# EAGLE schematic specMech (EAGLE 9.6.2)

## Sheet 1 of 7: MCU

## Sheet 2 of 7: Lantronix XPORT Ethernet
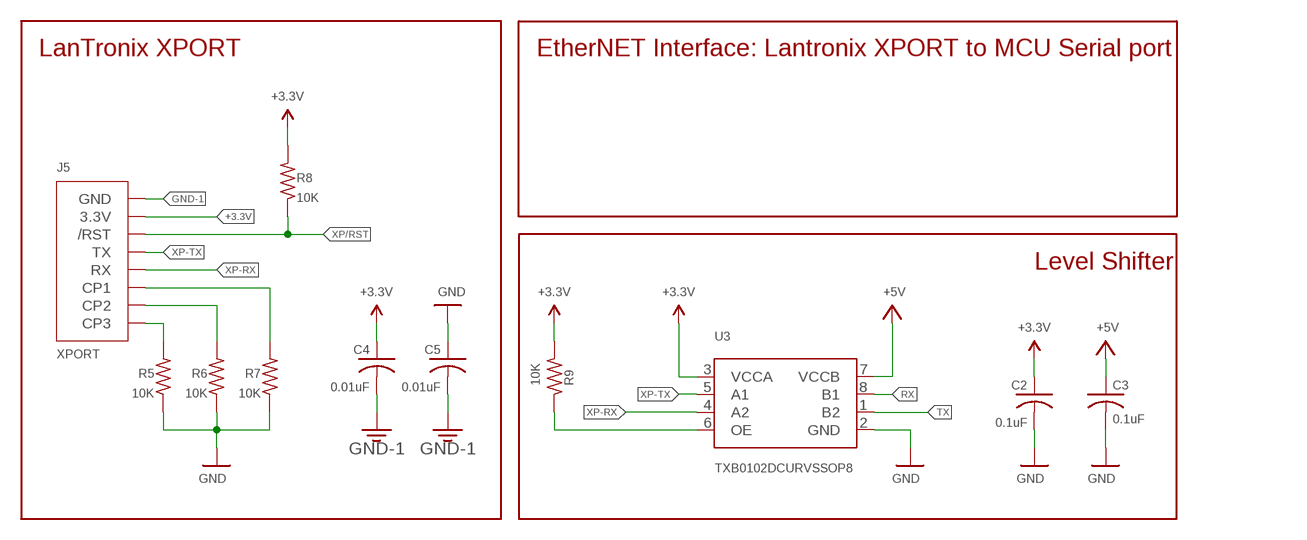
[diagram p0: schematic, sheet 2]

### Parts
C2  0.1uF  C-USC0805  [C0805]
C3  0.1uF  C-USC0805  [C0805]
C4  0.01uF  C-USC0805  [C0805]
C5  0.01uF  C-USC0805  [C0805]
J5  XPORT  XPORTXPORT-2  [XPORT-2]
R5  10K  R-US_R0805  [R0805]
R6  10K  R-US_R0805  [R0805]
R7  10K  R-US_R0805  [R0805]
R8  10K  R-US_R0805  [R0805]
R9  10K  R-US_R0805  [R0805]
U3  TXB0102DCURVSSOP8  [GHI-IC_VSSOP8(TI)]

### Nets
+3.3V: C2.1 C4.1 J5.3.3V R8.2 R9.2 U3.3(VCCA)
+5V: C3.1 U3.7(VCCB) ; also sheet 3,4,5,6,7
GND: C2.2 C3.2 C5.1 R5.1 R6.1 R7.1 U3.2(GND) ; also sheet 3,4,5,6,7
GND-1: C4.2 C5.2 J5.GND
N$40: J5.CP3 R5.2
N$41: J5.CP2 R6.2
N$42: J5.CP1 R7.2
N$43: R9.1 U3.6(OE)
RX: U3.8(B1)
TX: U3.1(B2)
XP-RX: J5.RX U3.4(A2)
XP-TX: J5.TX U3.5(A1)
XP/RST: J5./RST R8.1

### Notes on the sheet
- LanTronix XPORT | EtherNET Interface: Lantronix XPORT to MCU Serial port
- Level Shifter

## Sheet 3 of 7: Power
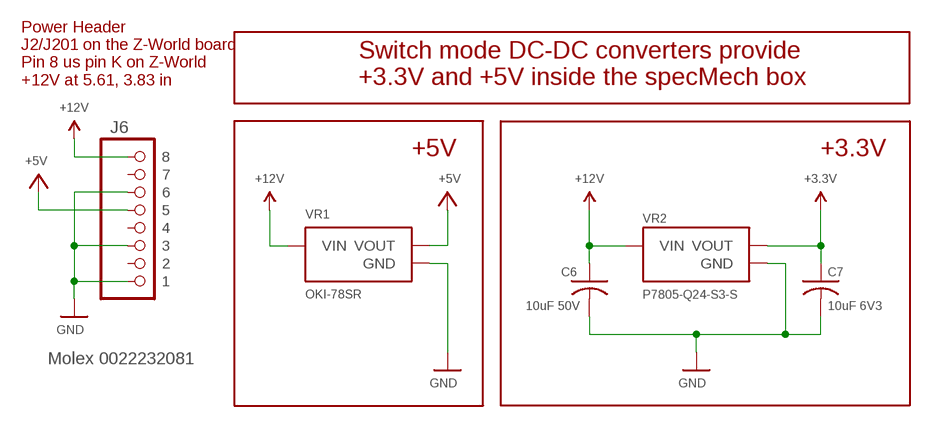
[diagram p1: schematic, sheet 3]

### Parts
C6  10uF 50V  C-USC1210  [C1210]
C7  10uF 6V3  C-USC0805  [C0805]
J6  Molex 0022232081  PINHD-1X8-MOLEX-SHROUD  [1X08-MOLEX-SHROUD]
VR1  OKI-78SR  [OKI-78SR]
VR2  P7805-Q24-S3-S  [CONV_P7805-Q24-S3-S]

### Nets
3.3V: C7.1 VR2.VOUT ; supply symbol labelled +3.3V
+5V: J6.P$5 VR1.VOUT ; also sheet 2,4,5,6,7
+12V: C6.1 J6.P$8 VR1.VIN VR2.VIN ; also sheet 6
GND: C6.2 C7.2 J6.P$1 J6.P$3 J6.P$6 VR1.GND VR2.GND ; also sheet 2,4,5,6,7
Unconnected: J6.P$2 J6.P$4 J6.P$7

### Notes on the sheet
- Power Header
  J2/J201 on the Z-World board
  Pin 8 us pin K on Z-World
  +12V at 5.61, 3.83 in
- Switch mode DC-DC converters provide
  +3.3V and +5V inside the specMech box
- +5V | +3.3V

## Sheet 4 of 7: Sensors
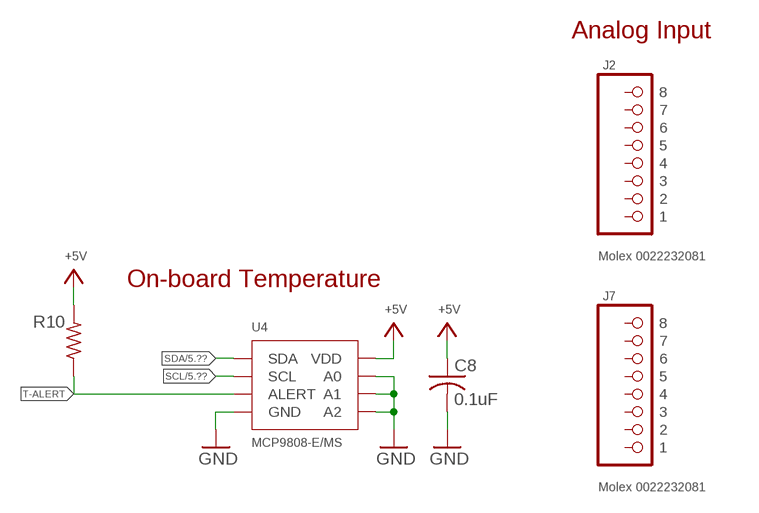
[diagram p2: schematic, sheet 4]

### Parts
C8  0.1uF  C-USC0805  [C0805]
J2  Molex 0022232081  PINHD-1X8-MOLEX-SHROUD  [1X08-MOLEX-SHROUD]
J7  Molex 0022232081  PINHD-1X8-MOLEX-SHROUD  [1X08-MOLEX-SHROUD]
R10  R-US_R0805  [R0805]
U4  MCP9808-E/MS  [MSOP8_MC_MCH]

### Nets
+5V: C8.1 R10.2 U4.8(VDD) ; also sheet 2,3,5,6,7
GND: C8.2 U4.4(GND) U4.5(A2) U4.6(A1) U4.7(A0) ; also sheet 2,3,5,6,7
SCL: U4.2(SCL) ; also sheet 5,6,7
SDA: U4.1(SDA) ; also sheet 5,6,7
T-ALERT: R10.1 U4.3(ALERT)
Unconnected: J2.P$1 J2.P$2 J2.P$3 J2.P$4 J2.P$5 J2.P$6 J2.P$7 J2.P$8 J7.P$1 J7.P$2 J7.P$3 J7.P$4 J7.P$5 J7.P$6 J7.P$7 J7.P$8

### Notes on the sheet
- Analog Input
- On-board Temperature

## Sheet 5 of 7: Digital I/O
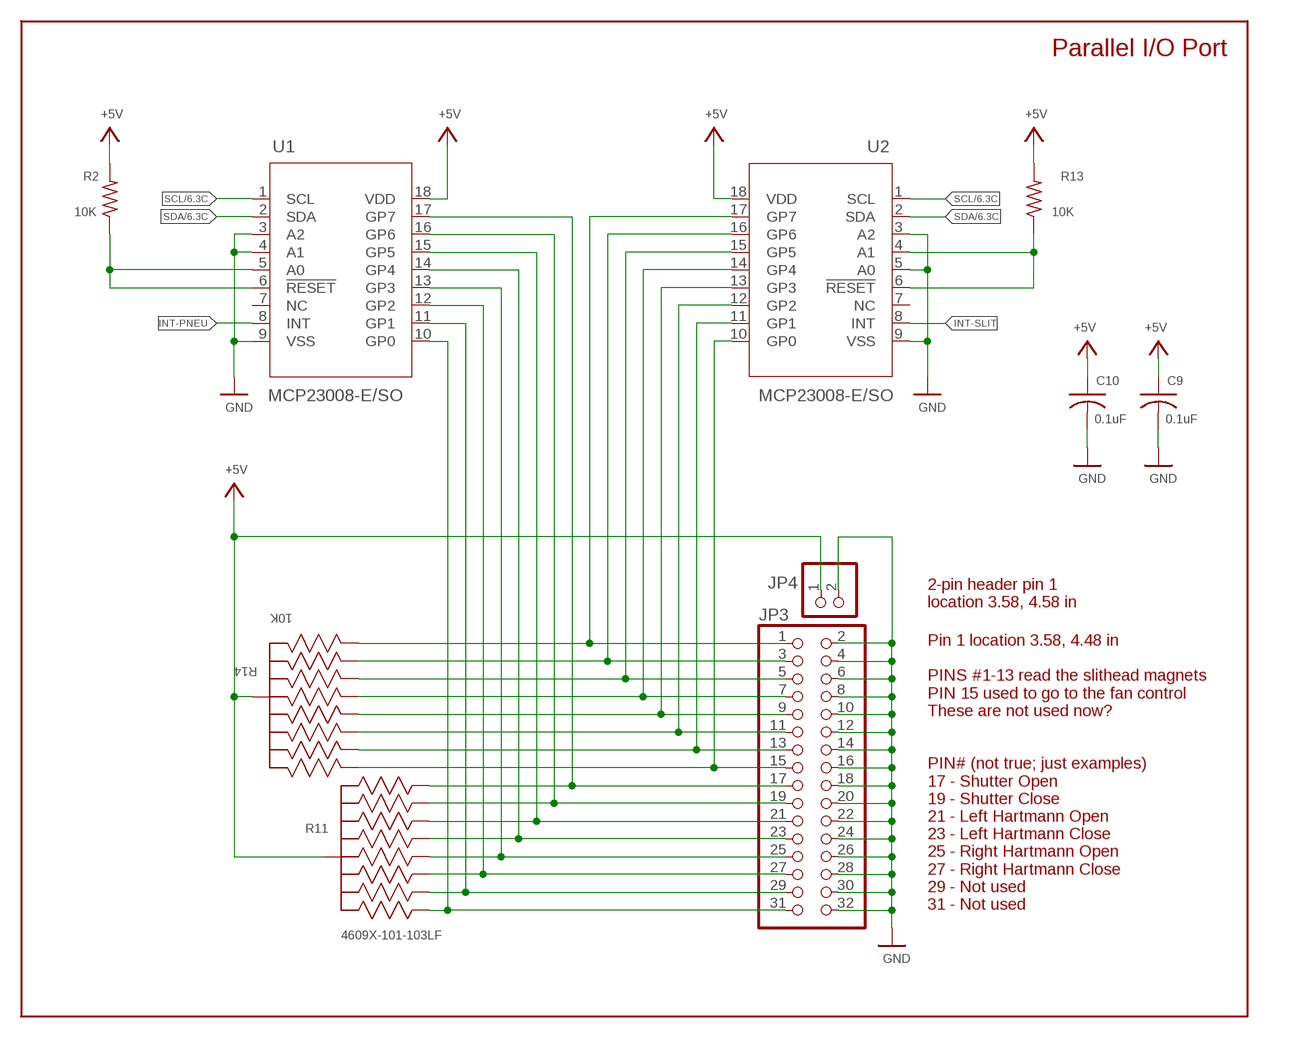
[diagram p3: schematic, sheet 5]

### Parts
C9  0.1uF  C-USC0805  [C0805]
C10  0.1uF  C-USC0805  [C0805]
JP3  PINHD-2X16  [2X16]
JP4  PINHD-1X2  [1X02]
R2  10K  R-US_R0805  [R0805]
R11  4609X-101-103LF  [BO_4609X]
R13  10K  R-US_R0805  [R0805]
R14  10K  4609X-101-103LF  [BO_4609X]
U1  MCP23008-E/SO  [SOIC18-W_MC]
U2  MCP23008-E/SO  [SOIC18-W_MC]

### Nets
+5V: C9.1 C10.1 JP4.1 R2.2 R11.1 R13.2 R14.1 U1.18(VDD) U2.18(VDD) ; also sheet 2,3,4,6,7
GND: C9.2 C10.2 JP3.2 JP3.4 JP3.6 JP3.8 JP3.10 JP3.12 JP3.14 JP3.16 JP3.18 JP3.20 JP3.22 JP3.24 JP3.26 JP3.28 JP3.30 JP3.32 JP4.2 U1.3(A2) U1.4(A1) U1.9(VSS) U2.3(A2) U2.5(A0) U2.9(VSS) ; also sheet 2,3,4,6,7
INT-PNEU: U1.8(INT)
INT-SLIT: U2.8(INT)
N$1: JP3.1 R14.2 U2.17(GP7)
N$2: JP3.3 R14.3 U2.16(GP6)
N$3: JP3.5 R14.4 U2.15(GP5)
N$4: JP3.7 R14.5 U2.14(GP4)
N$9: JP3.17 R11.9 U1.17(GP7)
N$10: JP3.19 R11.8 U1.16(GP6)
N$11: JP3.21 R11.7 U1.15(GP5)
N$12: JP3.23 R11.6 U1.14(GP4)
N$13: JP3.25 R11.5 U1.13(GP3)
N$14: R2.1 U1.5(A0) U1.6(!RESET)
N$15: JP3.29 R11.3 U1.11(GP1)
N$16: JP3.31 R11.2 U1.10(GP0)
N$17: JP3.11 R14.7 U2.12(GP2)
N$20: JP3.27 R11.4 U1.12(GP2)
N$21: JP3.13 R14.8 U2.11(GP1)
N$22: JP3.15 R14.9 U2.10(GP0)
N$24: R13.1 U2.4(A1) U2.6(!RESET)
N$36: JP3.9 R14.6 U2.13(GP3)
SCL: U1.1(SCL) U2.1(SCL) ; also sheet 4,6,7
SDA: U1.2(SDA) U2.2(SDA) ; also sheet 4,6,7
Unconnected: U1.7(NC) U2.7(NC)

### Notes on the sheet
- Parallel I/O Port
- 2-pin header pin 1
  location 3.58, 4.58 in
- Pin 1 location 3.58, 4.48 in
  
  PINS #1-13 read the slithead magnets
  PIN 15 used to go to the fan control
  These are not used now?
  
  
  PIN# (not true; just examples)
  17 - Shutter Open
  19 - Shutter Close
  21 - Left Hartmann Open
  23 - Left Hartmann Close
  25 - Right Hartmann Open
  27 - Right Hartmann Close
  29 - Not used
  31 - Not used

## Sheet 6 of 7: High Current Output
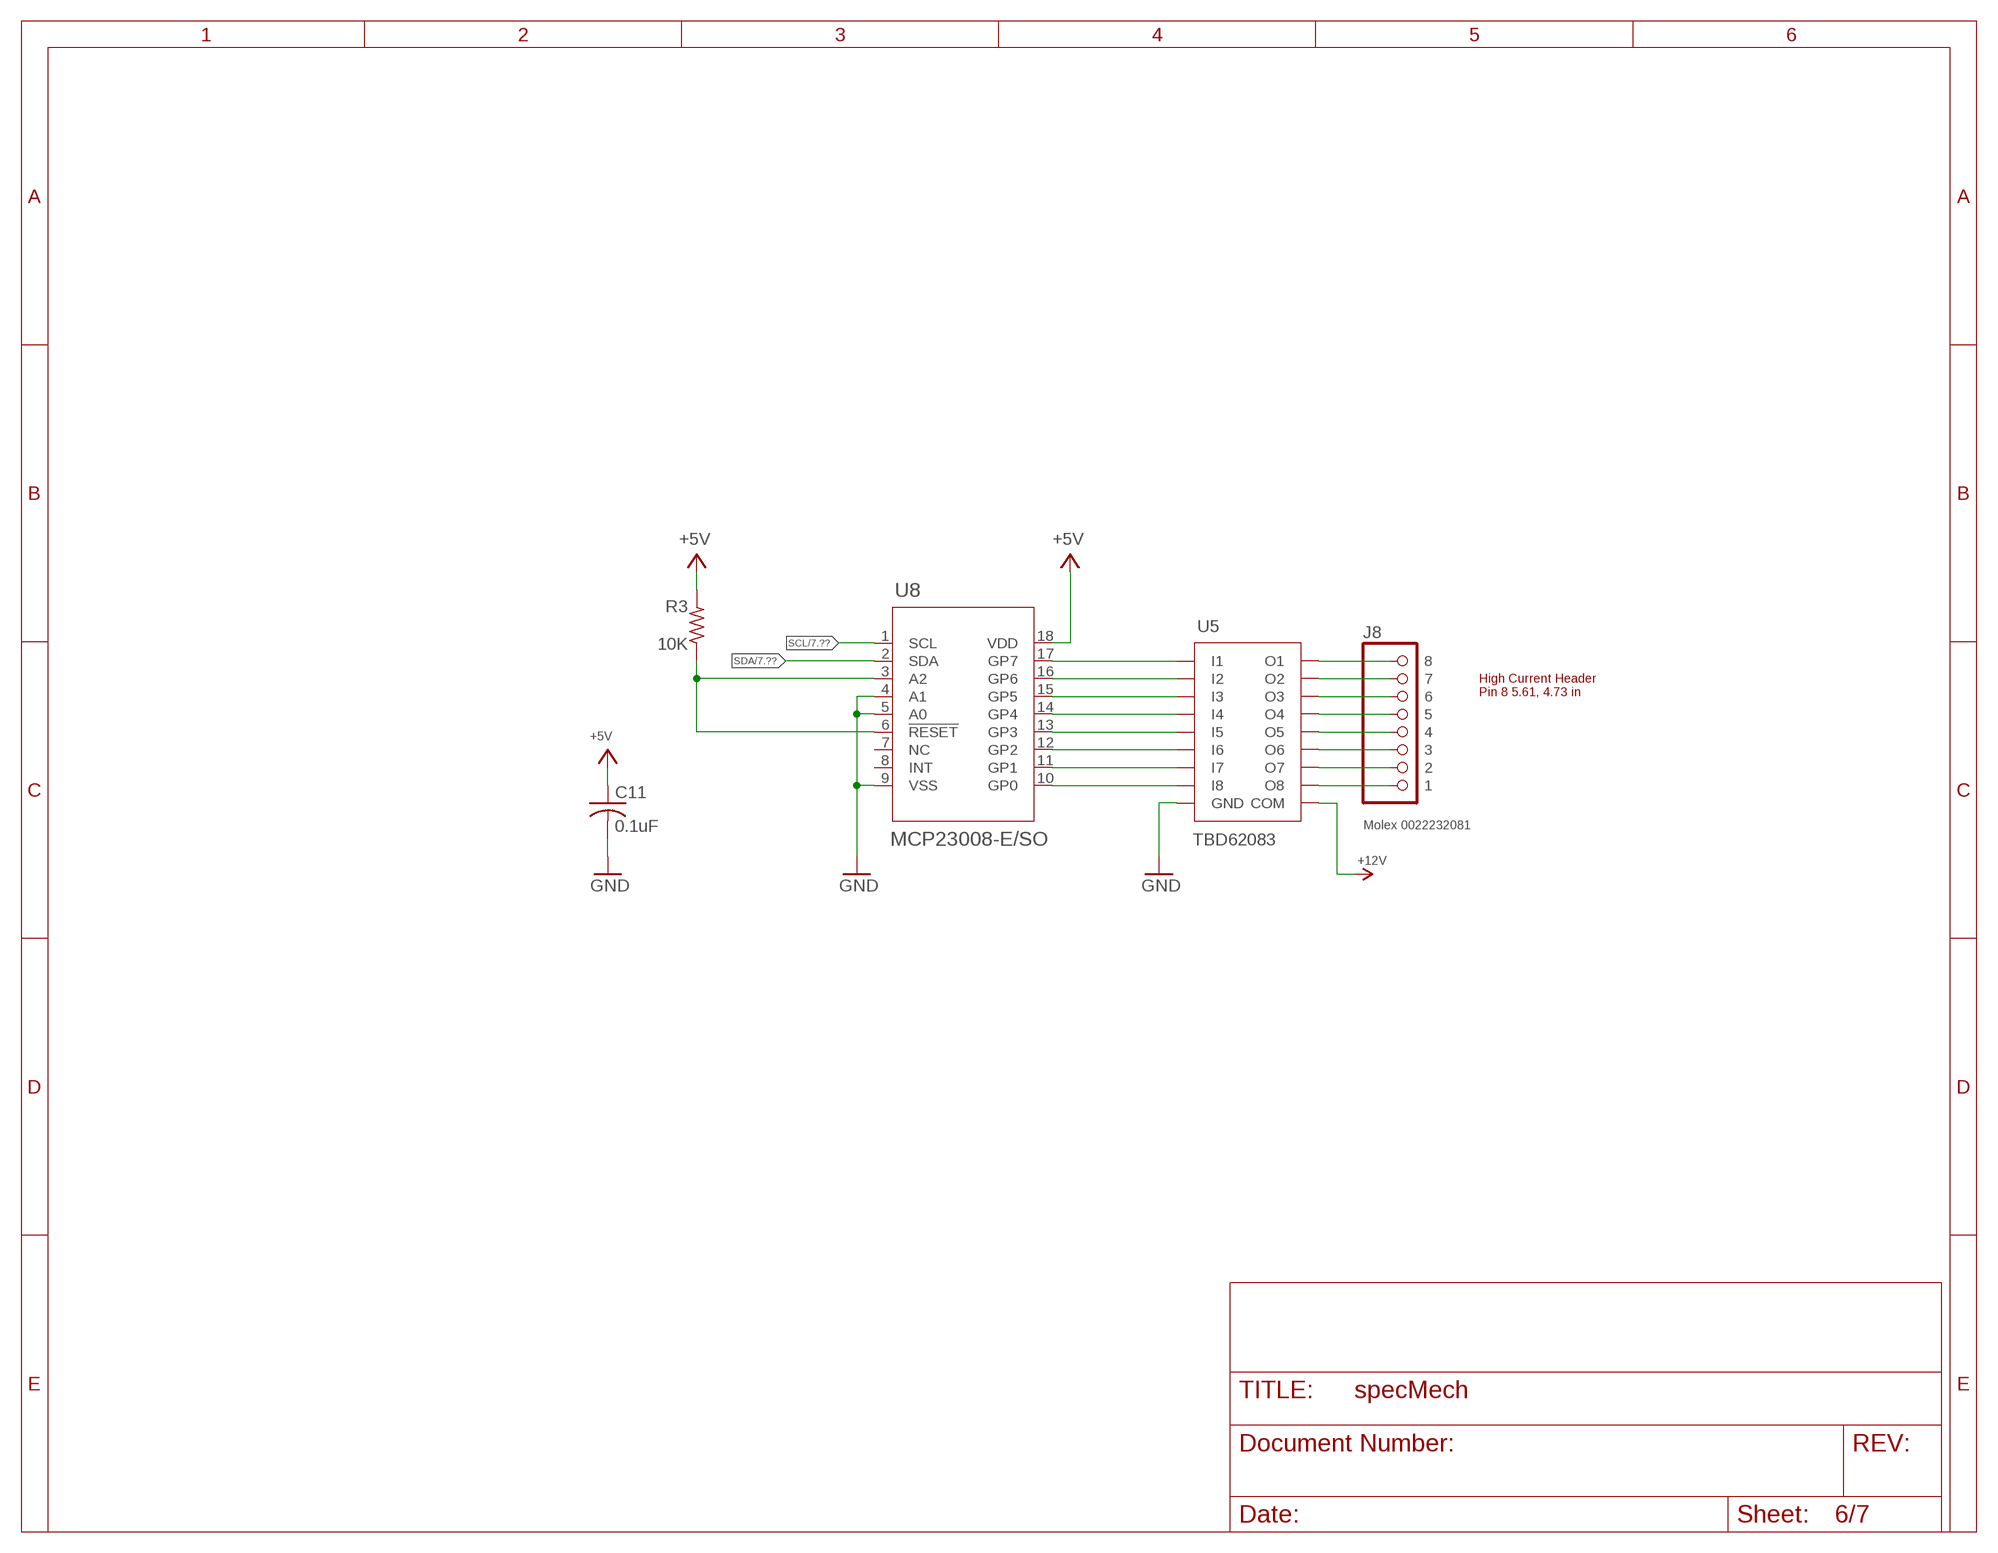
[diagram p4: schematic, sheet 6]

### Parts
C11  0.1uF  C-USC0805  [C0805]
J8  Molex 0022232081  PINHD-1X8-MOLEX-SHROUD  [1X08-MOLEX-SHROUD]
R3  10K  R-US_R0805  [R0805]
U5  TBD62083  TBD62083SOP18-P-375-1.27  [SOIC127P1030X245-18]
U8  MCP23008-E/SO  [SOIC18-W_MC]

### Nets
+5V: C11.1 R3.2 U8.18(VDD) ; also sheet 2,3,4,5,7
+12V: U5.10(COM) ; also sheet 3
GND: C11.2 U5.9(GND) U8.4(A1) U8.5(A0) U8.9(VSS) ; also sheet 2,3,4,5,7
N$37: U5.1(I1) U8.17(GP7)
N$38: U5.2(I2) U8.16(GP6)
N$39: U5.3(I3) U8.15(GP5)
N$44: U5.4(I4) U8.14(GP4)
N$45: U5.5(I5) U8.13(GP3)
N$46: U5.6(I6) U8.12(GP2)
N$47: U5.7(I7) U8.11(GP1)
N$48: U5.8(I8) U8.10(GP0)
N$49: R3.1 U8.3(A2) U8.6(!RESET)
N$50: J8.P$8 U5.18(O1)
N$51: J8.P$1 U5.11(O8)
N$52: J8.P$2 U5.12(O7)
N$53: J8.P$3 U5.13(O6)
N$54: J8.P$4 U5.14(O5)
N$55: J8.P$5 U5.15(O4)
N$56: J8.P$6 U5.16(O3)
N$57: J8.P$7 U5.17(O2)
SCL: U8.1(SCL) ; also sheet 4,5,7
SDA: U8.2(SDA) ; also sheet 4,5,7
Unconnected: U8.7(NC) U8.8(INT)

### Notes on the sheet
- High Current Header
  Pin 8 5.61, 4.73 in

## Sheet 7 of 7: Analog Input
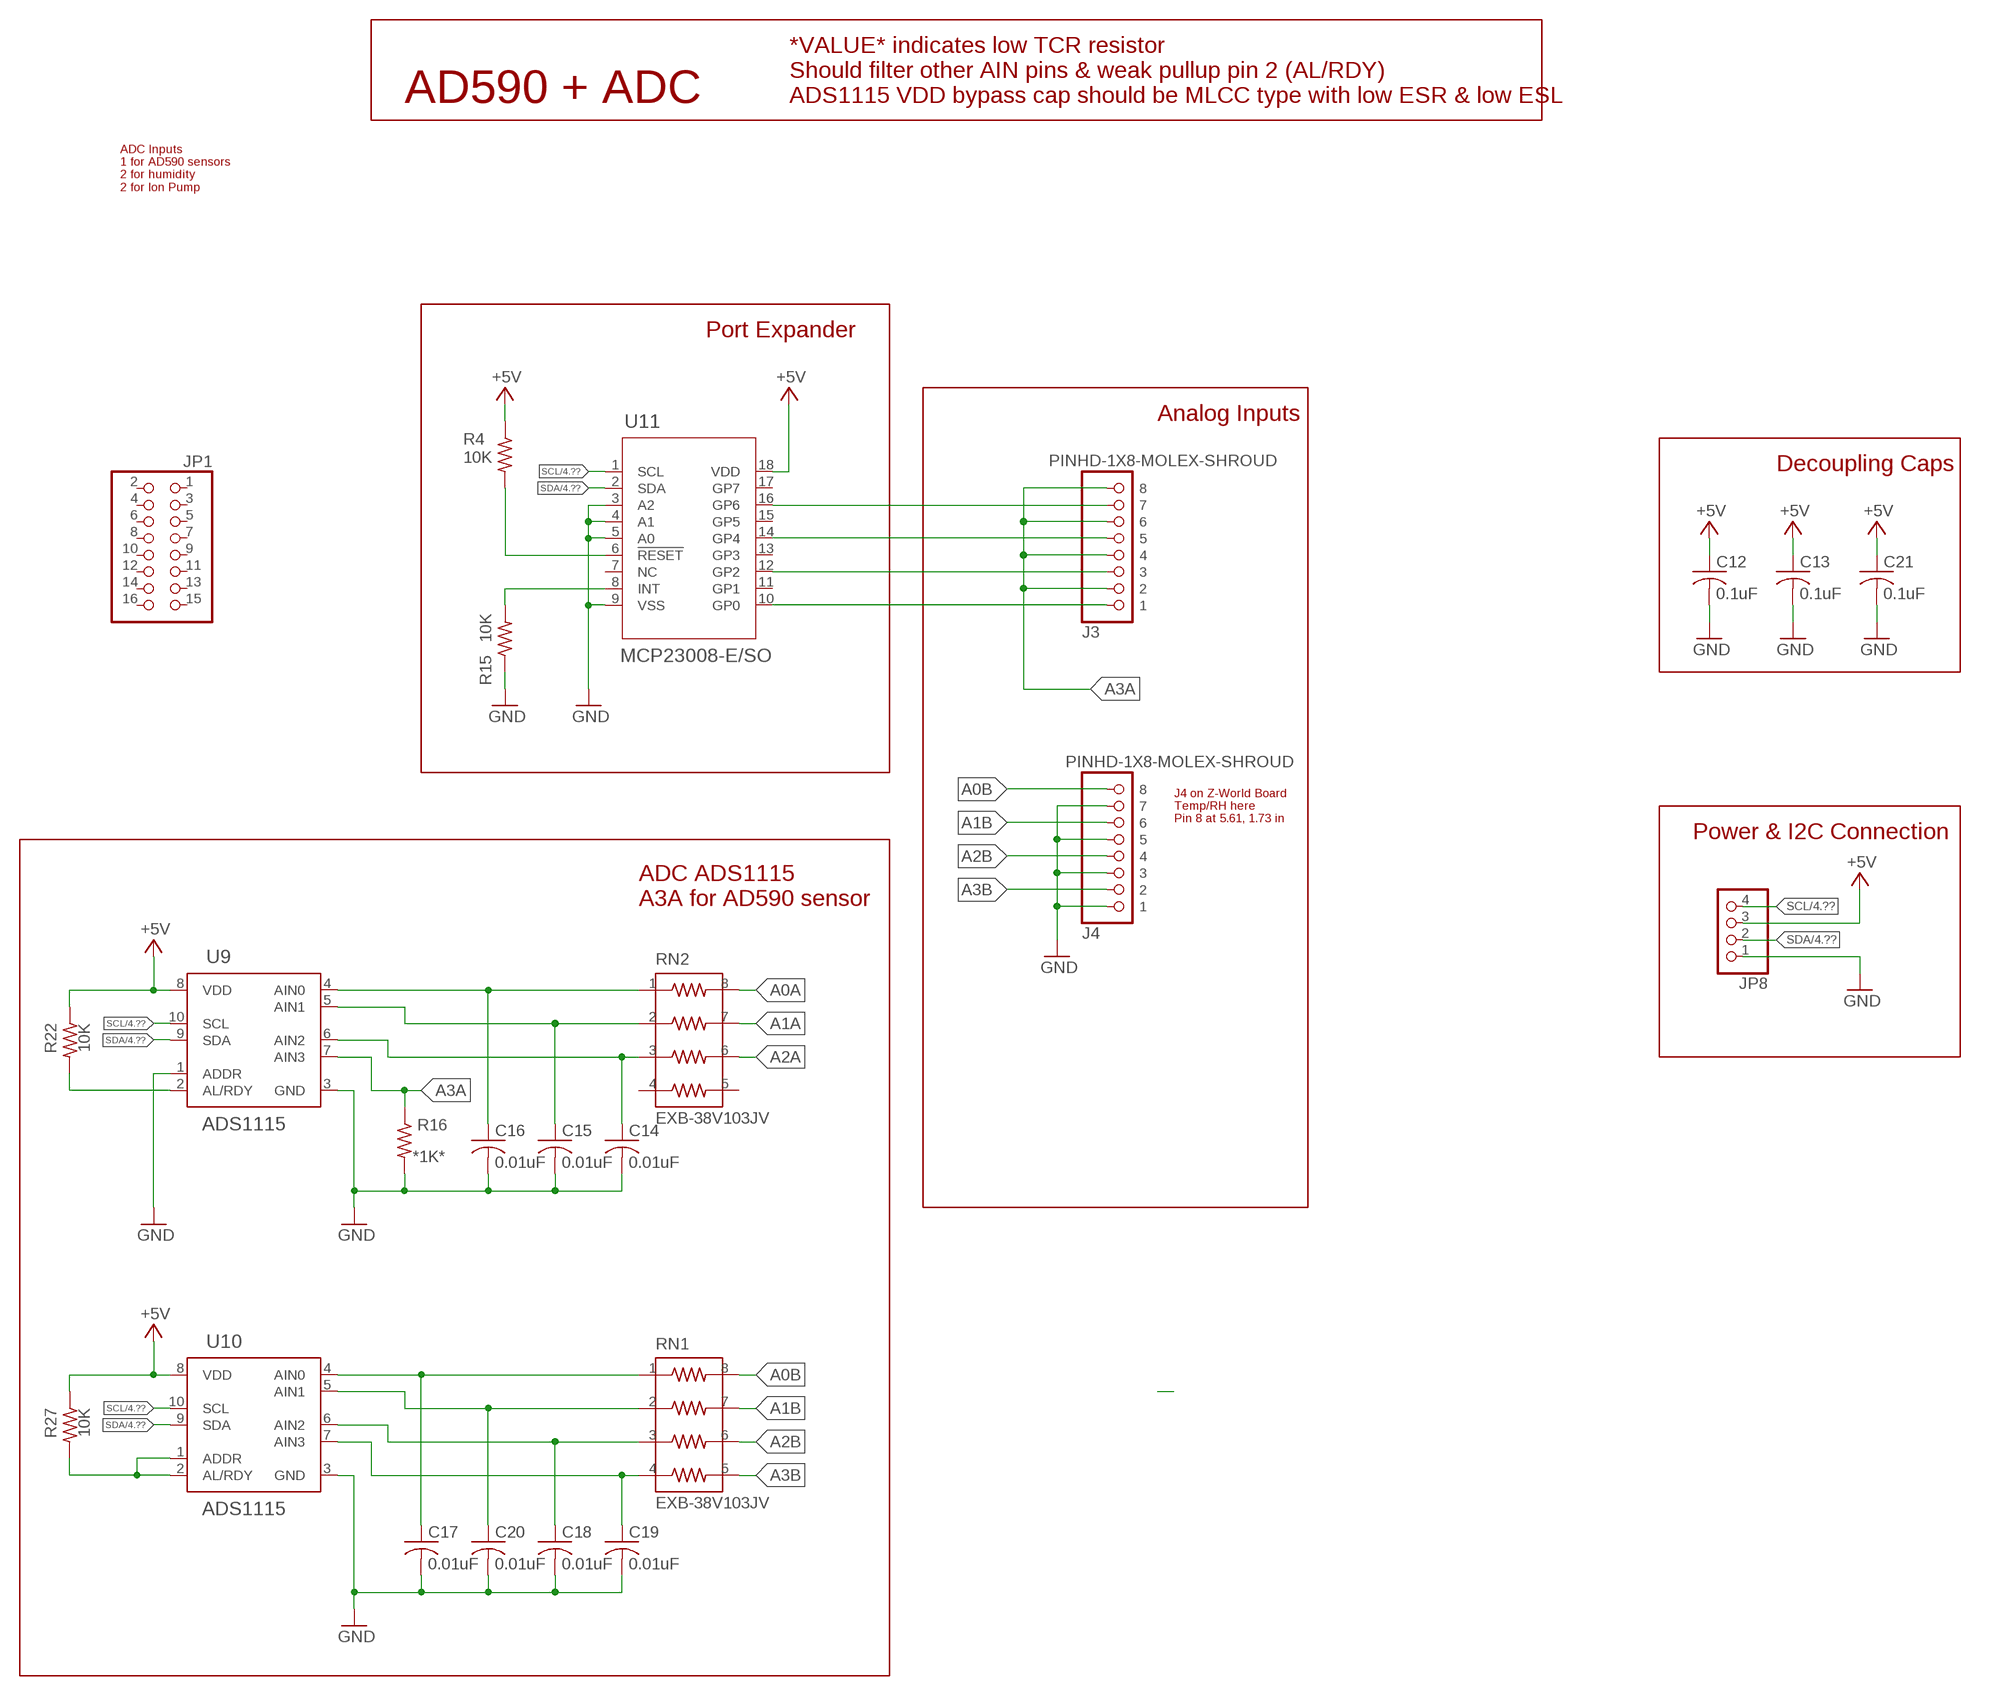
[diagram p5: schematic, sheet 7]

### Parts
C12  0.1uF  C-USC0805  [C0805]
C13  0.1uF  C-USC0805  [C0805]
C14  0.01uF  C-USC0805  [C0805]
C15  0.01uF  C-USC0805  [C0805]
C16  0.01uF  C-USC0805  [C0805]
C17  0.01uF  C-USC0805  [C0805]
C18  0.01uF  C-USC0805  [C0805]
C19  0.01uF  C-USC0805  [C0805]
C20  0.01uF  C-USC0805  [C0805]
C21  0.1uF  C-USC0805  [C0805]
J3  PINHD-1X8-MOLEX-SHROUD  [1X08-MOLEX-SHROUD]
J4  PINHD-1X8-MOLEX-SHROUD  [1X08-MOLEX-SHROUD]
JP1  PINHD-2X8  [2X08]
JP8  PINHD-1X4/90  [1X04/90]
R4  10K  R-US_R0805  [R0805]
R15  10K  R-US_R0805  [R0805]
R16  *1K*  R-US_R0805  [R0805]
R22  10K  R-US_R0805  [R0805]
R27  10K  R-US_R0805  [R0805]
RN1  EXB-38V103JV  [EXB38V_PAN]
RN2  EXB-38V103JV  [EXB38V_PAN]
U9  ADS1115  ADS1115IDGSRVSSOP-10  [SOP50P490X110-10N]
U10  ADS1115  ADS1115IDGSRVSSOP-10  [SOP50P490X110-10N]
U11  MCP23008-E/SO  [SOIC18-W_MC]

### Nets
+5V: C12.1 C13.1 C21.1 JP8.3 R4.1 R22.1 R27.1 U9.8(VDD) U10.8(VDD) U11.18(VDD) ; also sheet 2,3,4,5,6
A0A: RN2.8
A0B: J4.P$8 RN1.8
A1A: RN2.7
A1B: J4.P$6 RN1.7
A2A: RN2.6
A2B: J4.P$4 RN1.6
A3A: J3.P$2 J3.P$4 J3.P$6 J3.P$8 R16.1 U9.7(AIN3)
A3B: J4.P$2 RN1.5
GND: C12.2 C13.2 C14.2 C15.2 C16.2 C17.2 C18.2 C19.2 C20.2 C21.2 J4.P$1 J4.P$3 J4.P$5 J4.P$7 JP8.1 R15.1 R16.2 U9.1(ADDR) U9.3(GND) U10.3(GND) U11.3(A2) U11.4(A1) U11.5(A0) U11.9(VSS) ; also sheet 2,3,4,5,6
N$5: R4.2 U11.6(!RESET)
N$18: R15.2 U11.8(INT)
N$60: J3.P$1 U11.10(GP0)
N$61: J3.P$3 U11.12(GP2)
N$62: C16.1 RN2.1 U9.4(AIN0)
N$63: C15.1 RN2.2 U9.5(AIN1)
N$64: R22.2 U9.2(AL/RDY)
N$65: C19.1 RN1.4 U10.7(AIN3)
N$66: C14.1 RN2.3 U9.6(AIN2)
N$67: C18.1 RN1.3 U10.6(AIN2)
N$68: C20.1 RN1.2 U10.5(AIN1)
N$69: C17.1 RN1.1 U10.4(AIN0)
N$70: R27.2 U10.1(ADDR) U10.2(AL/RDY)
N$71: J3.P$5 U11.14(GP4)
N$72: J3.P$7 U11.16(GP6)
SCL: JP8.4 U9.10(SCL) U10.10(SCL) U11.1(SCL) ; also sheet 4,5,6
SDA: JP8.2 U9.9(SDA) U10.9(SDA) U11.2(SDA) ; also sheet 4,5,6
Unconnected: JP1.1 JP1.2 JP1.3 JP1.4 JP1.5 JP1.6 JP1.7 JP1.8 JP1.9 JP1.10 JP1.11 JP1.12 JP1.13 JP1.14 JP1.15 JP1.16 RN2.4 RN2.5 U11.7(NC) U11.11(GP1) U11.13(GP3) U11.15(GP5) U11.17(GP7)

### Notes on the sheet
- AD590 + ADC
- *VALUE* indicates low TCR resistor
  Should filter other AIN pins & weak pullup pin 2 (AL/RDY)
  ADS1115 VDD bypass cap should be MLCC type with low ESR & low ESL
- ADC Inputs
  1 for AD590 sensors
  2 for humidity
  2 for Ion Pump
- Port Expander
- Analog Inputs
- Decoupling Caps
- J4 on Z-World Board
  Temp/RH here
  Pin 8 at 5.61, 1.73 in
- Power & I2C Connection
- ADC ADS1115
  A3A for AD590 sensor

## Library data of the parts
C2-C21 = AUmlib:C-US: CAPACITOR, American symbol; SPICEPREFIX: C
J2-J4 J6-J8 = AUmlib:PINHD-1X8-MOLEX-SHROUD: 8-pin vertical header Molex 0022232081 tin plated version Digikey WM4206-ND $0.50 each 2020-09-15
J5 = AUmlib:XPORT
JP1 = AUmlib:PINHD-2X8: PIN HEADER
JP3 = AUmlib:PINHD-2X16: PIN HEADER
JP4 = AUmlib:PINHD-1X2: PIN HEADER
JP8 = AUmlib:PINHD-1X4: PIN HEADER
R2-R10 R13 R15 R16 R22 R27 = AUmlib:R-US_: RESISTOR, American symbol; SPICEPREFIX: R
R11 R14 = AUmlib:4609X-101-103LF: Resistor array 8X bussed; MANUFACTURER_PART_NUMBER: 4609X101103LF; VENDOR: Bourns Electronics
RN1 RN2 = AUmlib:EXB-38V103JV: Res Thick Film Array 10K Ohm 5% ?200ppm/C ISOL Molded 8-Pin 1206(4 X 0603) Convex SMD Automotive T/R; DESCRIPTION: 10k Ohm ±5% 62.5mW Power Per Element Isolated Resistor Network/Array ±200ppm/°C 1206 (3216 Metric), Convex, Long Side Terminals; DIGI-KEY_PART_NUMBER: Y9103CT-ND; MF: Panasonic; MP: EXB-38V103JV; PACKAGE: 1206 Panasonic; PURCHASE-URL: https://pricing.snapeda.com/search/part/EXB-38V103JV/?ref=eda
U1 U2 U8 U11 = AUmlib:MCP23008-E/SO; BUILT_BY: EMA_UL_Team; MANUFACTURER_PART_NUMBER: MCP23008-E/SO; VENDOR: Microchip
U3 = AUmlib:TXB0102DCUR
U4 = AUmlib:MCP9808-E/MS; BUILT_BY: EMA_UL_Team; MANUFACTURER_PART_NUMBER: MCP9808-E/MS; SOURCELIBRARY: Microchip_2014-11-20; VENDOR: Microchip
U5 = AUmlib:TBD62083: Toshiba TBD62083 high current driver, ULN2308 replacement
U9 U10 = AUmlib:ADS1115IDGSR: ADS1115 16-bit ADC with I2C communications
VR1 = AUmlib:OKI-78SR
VR2 = AUmlib:P7805-Q24-S3-S: CUI P7805-Q24-S3-S DC-DC Converter 3.3V 2W Digikey 102-2704-ND $4.94 2020-09-14; AVAILABILITY: Good; DESCRIPTION: 3.3V 2W; MF: CUI; MP: P7805-Q12-S1R5-S; PACKAGE: SIP-3 CUI; PRICE: $4.94